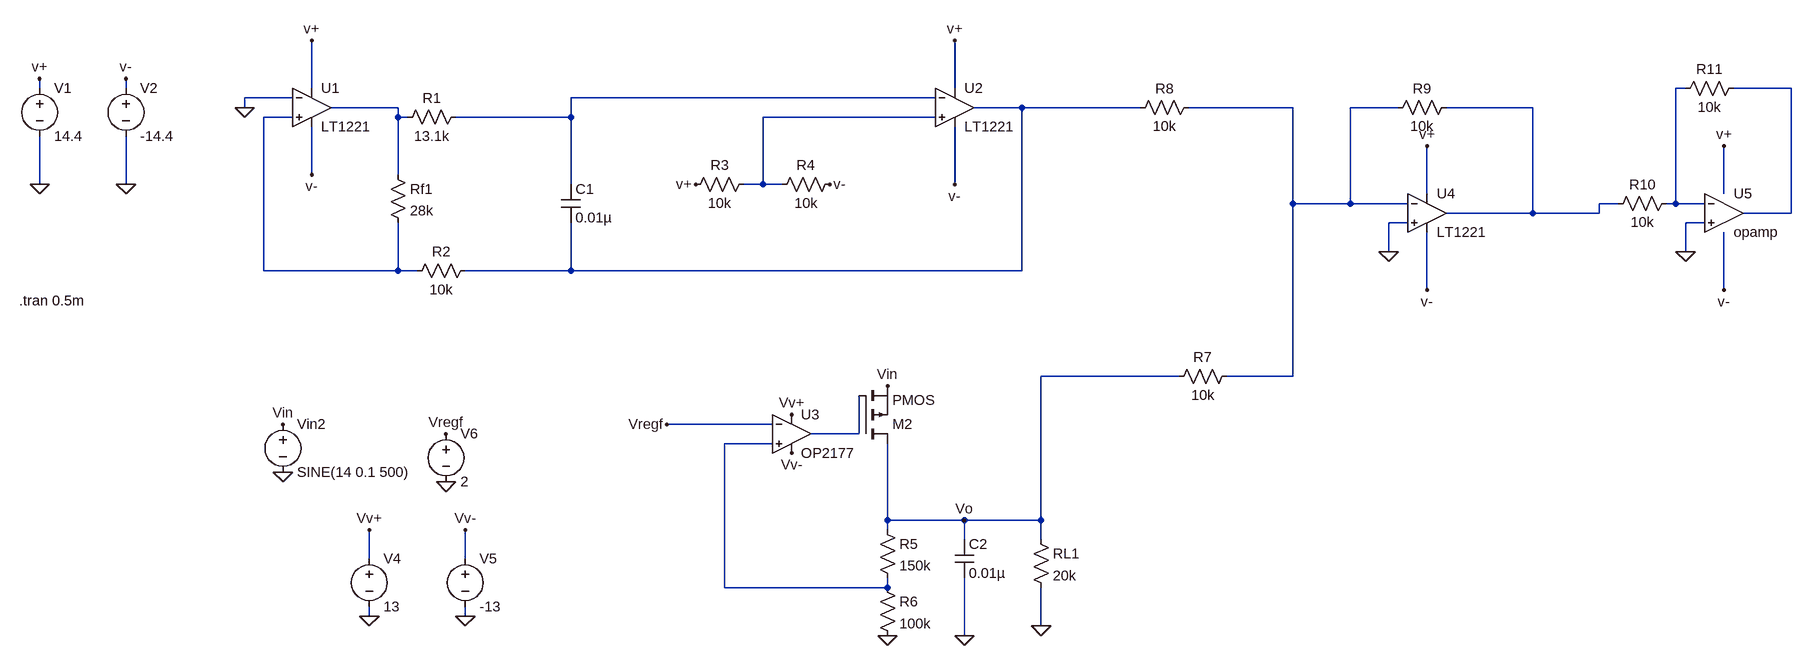
[diagram p0: schematic posible_circuito_gernerador_con_sumador.asc]
posible_circuito_gernerador_con_sumador.asc, the LTspice schematic file:
Version 4
SHEET 1 2420 1000
WIRE -944 48 -944 32
WIRE -800 48 -800 32
WIRE -352 48 -352 -32
WIRE 720 48 720 -32
WIRE 2240 48 2224 48
WIRE 2416 48 2320 48
WIRE -384 64 -464 64
WIRE 688 64 80 64
WIRE -464 80 -464 64
WIRE -208 80 -320 80
WIRE 832 80 752 80
WIRE 1248 80 832 80
WIRE 1520 80 1328 80
WIRE 1696 80 1616 80
WIRE 1920 80 1776 80
WIRE -384 96 -432 96
WIRE -208 96 -208 80
WIRE -192 96 -208 96
WIRE 80 96 80 64
WIRE 80 96 -112 96
WIRE 688 96 400 96
WIRE -352 192 -352 112
WIRE -208 192 -208 96
WIRE -944 208 -944 128
WIRE -800 208 -800 128
WIRE 80 208 80 96
WIRE 400 208 400 96
WIRE 400 208 368 208
WIRE 432 208 400 208
WIRE 720 208 720 112
WIRE 1744 224 1744 144
WIRE 2304 224 2304 144
WIRE 1520 240 1520 80
WIRE 1616 240 1616 80
WIRE 1616 240 1520 240
WIRE 1712 240 1616 240
WIRE 2128 240 2096 240
WIRE 2224 240 2224 48
WIRE 2224 240 2208 240
WIRE 2272 240 2224 240
WIRE 1920 256 1920 80
WIRE 1920 256 1776 256
WIRE 2096 256 2096 240
WIRE 2096 256 1920 256
WIRE 2416 256 2416 48
WIRE 2416 256 2336 256
WIRE 1712 272 1680 272
WIRE 2272 272 2240 272
WIRE 1680 320 1680 272
WIRE 2240 320 2240 272
WIRE -432 352 -432 96
WIRE -208 352 -208 272
WIRE -208 352 -432 352
WIRE -176 352 -208 352
WIRE 80 352 80 272
WIRE 80 352 -96 352
WIRE 832 352 832 80
WIRE 832 352 80 352
WIRE 1744 384 1744 288
WIRE 2304 384 2304 288
WIRE 1312 528 864 528
WIRE 1520 528 1520 240
WIRE 1520 528 1392 528
WIRE 416 608 240 608
WIRE 560 624 560 560
WIRE 560 624 480 624
WIRE 416 640 336 640
WIRE 608 768 608 640
WIRE 736 768 608 768
WIRE 864 768 864 528
WIRE 864 768 736 768
WIRE 608 784 608 768
WIRE 736 800 736 768
WIRE 864 800 864 768
WIRE -256 832 -256 784
WIRE -96 832 -96 784
WIRE 336 880 336 640
WIRE 608 880 608 864
WIRE 608 880 336 880
WIRE -256 928 -256 912
WIRE -96 928 -96 912
WIRE 864 944 864 880
WIRE 736 960 736 864
FLAG -352 -32 v+
FLAG 720 -32 v+
FLAG -352 192 v-
FLAG 720 208 v-
FLAG -464 80 0
FLAG 288 208 v+
FLAG 512 208 v-
FLAG -944 208 0
FLAG -800 208 0
FLAG -944 32 v+
FLAG -800 32 v-
FLAG 608 544 Vin
FLAG 240 608 Vregf
FLAG 736 960 0
FLAG 608 960 0
FLAG 736 768 Vo
FLAG -256 928 0
FLAG -96 928 0
FLAG -256 784 Vv+
FLAG -96 784 Vv-
FLAG 448 592 Vv+
FLAG 448 656 Vv-
FLAG 864 944 0
FLAG -400 608 Vin
FLAG -400 688 0
FLAG -128 624 Vregf
FLAG -128 704 0
FLAG 1744 144 v+
FLAG 1744 384 v-
FLAG 1680 320 0
FLAG 2304 144 v+
FLAG 2304 384 v-
FLAG 2240 320 0
SYMBOL res -224 176 R0
SYMATTR InstName Rf1
SYMATTR Value 28k
SYMBOL res -96 80 R90
WINDOW 0 0 56 VBottom 2
WINDOW 3 32 56 VTop 2
SYMATTR InstName R1
SYMATTR Value 13.1k
SYMBOL res -80 336 R90
WINDOW 0 0 56 VBottom 2
WINDOW 3 32 56 VTop 2
SYMATTR InstName R2
SYMATTR Value 10k
SYMBOL cap 64 208 R0
SYMATTR InstName C1
SYMATTR Value 0.01µ
SYMBOL Opamps\\LT1221 -352 16 R0
SYMATTR InstName U1
SYMBOL Opamps\\LT1221 720 16 R0
SYMATTR InstName U2
SYMBOL res 384 192 R90
WINDOW 0 0 56 VBottom 2
WINDOW 3 32 56 VTop 2
SYMATTR InstName R3
SYMATTR Value 10k
SYMBOL res 528 192 R90
WINDOW 0 0 56 VBottom 2
WINDOW 3 32 56 VTop 2
SYMATTR InstName R4
SYMATTR Value 10k
SYMBOL voltage -944 32 R0
WINDOW 123 0 0 Left 0
WINDOW 39 0 0 Left 0
SYMATTR InstName V1
SYMATTR Value 14.4
SYMBOL voltage -800 32 R0
WINDOW 123 0 0 Left 0
WINDOW 39 0 0 Left 0
SYMATTR InstName V2
SYMATTR Value -14.4
SYMBOL cap 720 800 R0
SYMATTR InstName C2
SYMATTR Value 0.01µ
SYMBOL res 592 768 R0
SYMATTR InstName R5
SYMATTR Value 150k
SYMBOL res 592 864 R0
SYMATTR InstName R6
SYMATTR Value 100k
SYMBOL voltage -256 816 R0
WINDOW 123 0 0 Left 0
WINDOW 39 0 0 Left 0
SYMATTR InstName V4
SYMATTR Value 13
SYMBOL voltage -96 816 R0
WINDOW 123 0 0 Left 0
WINDOW 39 0 0 Left 0
SYMATTR InstName V5
SYMATTR Value -13
SYMBOL Opamps\\OP2177 448 560 R0
SYMATTR InstName U3
SYMBOL pmos 560 640 M180
SYMATTR InstName M2
SYMBOL res 848 784 R0
SYMATTR InstName RL1
SYMATTR Value 20k
SYMBOL voltage -400 592 R0
WINDOW 123 0 0 Left 0
WINDOW 39 0 0 Left 0
SYMATTR InstName Vin2
SYMATTR Value SINE(14 0.1 500)
SYMBOL voltage -128 608 R0
WINDOW 123 0 0 Left 0
WINDOW 39 0 0 Left 0
SYMATTR InstName V6
SYMATTR Value 2
SYMBOL Opamps\\LT1221 1744 192 R0
SYMATTR InstName U4
SYMBOL res 1408 512 R90
WINDOW 0 0 56 VBottom 2
WINDOW 3 32 56 VTop 2
SYMATTR InstName R7
SYMATTR Value 10k
SYMBOL res 1344 64 R90
WINDOW 0 0 56 VBottom 2
WINDOW 3 32 56 VTop 2
SYMATTR InstName R8
SYMATTR Value 10k
SYMBOL res 1792 64 R90
WINDOW 0 0 56 VBottom 2
WINDOW 3 32 56 VTop 2
SYMATTR InstName R9
SYMATTR Value 10k
SYMBOL res 2224 224 R90
WINDOW 0 0 56 VBottom 2
WINDOW 3 32 56 VTop 2
SYMATTR InstName R10
SYMATTR Value 10k
SYMBOL res 2336 32 R90
WINDOW 0 0 56 VBottom 2
WINDOW 3 32 56 VTop 2
SYMATTR InstName R11
SYMATTR Value 10k
SYMBOL Opamps\\opamp 2304 192 R0
SYMATTR InstName U5
TEXT -978 402 Left 2 !.tran 0.5m

The netlist it stands for:
* posible_circuito_gernerador_con_sumador.asc
Rf1 N004 N008 28k
R1 N003 N004 13.1k
R2 N005 N008 10k
C1 N003 N005 0.01µ
XU1 N008 0 v+ v- N004 LT1221  ; pins In+ In- V+ V- OUT
XU2 N009 N003 v+ v- N005 LT1221  ; pins In+ In- V+ V- OUT
R3 N009 v+ 10k
R4 v- N009 10k
V1 v+ 0 14.4
V2 v- 0 -14.4
C2 Vo 0 0.01µ
R5 Vo N011 150k
R6 N011 0 100k
V4 Vv+ 0 13
V5 Vv- 0 -13
XU3 N011 Vregf Vv+ Vv- N010 OP2177  ; pins In+ In- V+ V- OUT
M2 Vo N010 Vin Vin PMOS
RL1 Vo 0 20k
Vin2 Vin 0 SINE(14 0.1 500)
V6 Vregf 0 2
XU4 0 N006 v+ v- N007 LT1221  ; pins In+ In- V+ V- OUT
R7 N006 Vo 10k
R8 N006 N005 10k
R9 N007 N006 10k
R10 N001 N007 10k
R11 N002 N001 10k
XU5 N001 0 N002 opamp Aol=100K GBW=10Meg  ; pins invin noninvin out
.model NMOS NMOS
.model PMOS PMOS
.lib standard.mos
.tran 0.5m
.backanno
.end